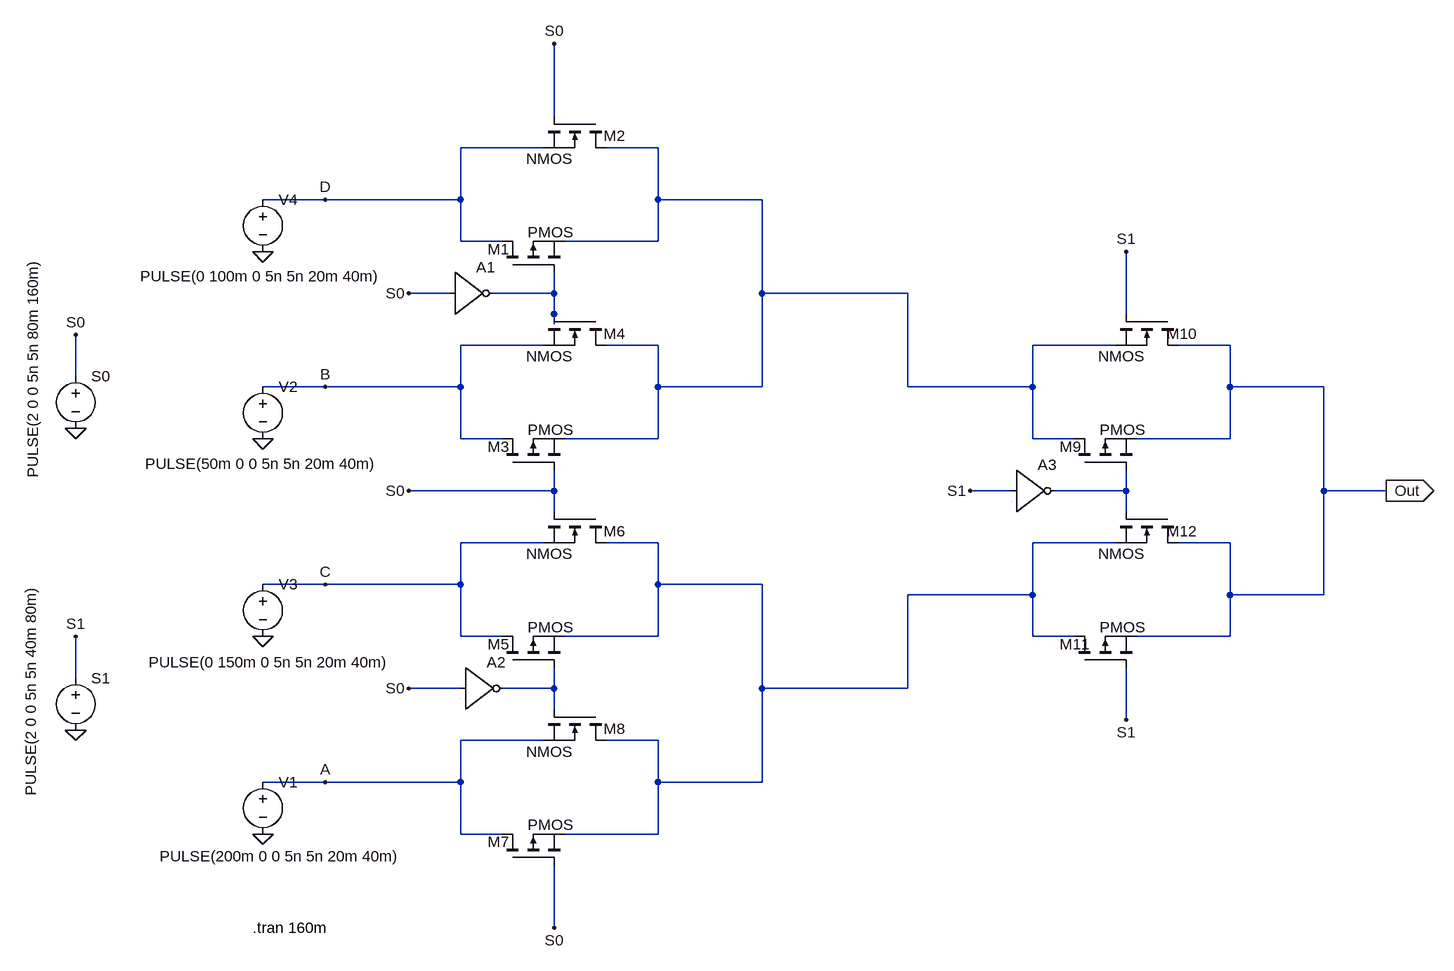
[diagram p0: schematic 4 to 1 mux (1).asc]
4 to 1 mux (1).asc, the LTspice schematic file:
Version 4
SHEET 1 1412 896
WIRE 32 -448 32 -560
WIRE 16 -400 -112 -400
WIRE 192 -400 112 -400
WIRE -320 -320 -416 -320
WIRE -112 -320 -112 -400
WIRE -112 -320 -320 -320
WIRE 192 -320 192 -400
WIRE 352 -320 192 -320
WIRE -112 -256 -112 -320
WIRE -48 -256 -112 -256
WIRE 192 -256 192 -320
WIRE 192 -256 48 -256
WIRE -128 -176 -192 -176
WIRE 32 -176 32 -208
WIRE 32 -176 -64 -176
WIRE 352 -176 352 -320
WIRE 576 -176 352 -176
WIRE 32 -144 32 -176
WIRE 912 -144 912 -240
WIRE 32 -128 32 -144
WIRE 16 -96 -112 -96
WIRE 192 -96 112 -96
WIRE 896 -96 768 -96
WIRE 1072 -96 992 -96
WIRE -704 -48 -704 -112
WIRE -320 -32 -416 -32
WIRE -112 -32 -112 -96
WIRE -112 -32 -320 -32
WIRE 192 -32 192 -96
WIRE 352 -32 352 -176
WIRE 352 -32 192 -32
WIRE 576 -32 576 -176
WIRE 768 -32 768 -96
WIRE 768 -32 576 -32
WIRE 1072 -32 1072 -96
WIRE 1216 -32 1072 -32
WIRE -112 48 -112 -32
WIRE -48 48 -112 48
WIRE 192 48 192 -32
WIRE 192 48 48 48
WIRE 768 48 768 -32
WIRE 832 48 768 48
WIRE 1072 48 1072 -32
WIRE 1072 48 928 48
WIRE 32 128 32 96
WIRE 32 128 -192 128
WIRE 736 128 672 128
WIRE 912 128 912 96
WIRE 912 128 800 128
WIRE 1216 128 1216 -32
WIRE 1312 128 1216 128
WIRE 32 160 32 128
WIRE 912 160 912 128
WIRE 16 208 -112 208
WIRE 192 208 112 208
WIRE 896 208 768 208
WIRE 1072 208 992 208
WIRE -320 272 -416 272
WIRE -112 272 -112 208
WIRE -112 272 -320 272
WIRE 192 272 192 208
WIRE 352 272 192 272
WIRE 768 288 768 208
WIRE 768 288 576 288
WIRE 1072 288 1072 208
WIRE 1216 288 1216 128
WIRE 1216 288 1072 288
WIRE -112 352 -112 272
WIRE -48 352 -112 352
WIRE 192 352 192 272
WIRE 192 352 48 352
WIRE 768 352 768 288
WIRE 832 352 768 352
WIRE 1072 352 1072 288
WIRE 1072 352 928 352
WIRE -704 416 -704 352
WIRE -112 432 -192 432
WIRE 32 432 32 400
WIRE 32 432 -48 432
WIRE 352 432 352 272
WIRE 576 432 576 288
WIRE 576 432 352 432
WIRE 32 464 32 432
WIRE 912 480 912 400
WIRE 16 512 -112 512
WIRE 192 512 112 512
WIRE -320 576 -416 576
WIRE -112 576 -112 512
WIRE -112 576 -320 576
WIRE 192 576 192 512
WIRE 352 576 352 432
WIRE 352 576 192 576
WIRE -112 656 -112 576
WIRE -48 656 -112 656
WIRE 192 656 192 576
WIRE 192 656 48 656
WIRE 32 800 32 704
FLAG 1312 128 Out
IOPIN 1312 128 Out
FLAG -416 -240 0
FLAG -416 48 0
FLAG -416 352 0
FLAG -416 656 0
FLAG -704 32 0
FLAG -704 496 0
FLAG -704 -112 S0
FLAG -704 352 S1
FLAG 672 128 S1
FLAG 912 -240 S1
FLAG 912 480 S1
FLAG -192 -176 S0
FLAG -192 128 S0
FLAG -192 432 S0
FLAG 32 800 S0
FLAG 32 -560 S0
FLAG -320 -32 B
FLAG -320 272 C
FLAG -320 -320 D
FLAG -320 576 A
SYMBOL pmos -48 -208 R270
WINDOW 0 36 -22 VRight 2
WINDOW 3 62 39 VRight 2
SYMATTR InstName M1
SYMBOL nmos 112 -448 R90
WINDOW 0 30 -30 VRight 2
WINDOW 3 65 51 VRight 2
SYMATTR InstName M2
SYMBOL pmos -48 96 R270
WINDOW 0 36 -22 VRight 2
WINDOW 3 62 39 VRight 2
SYMATTR InstName M3
SYMBOL nmos 112 -144 R90
WINDOW 0 30 -30 VRight 2
WINDOW 3 65 51 VRight 2
SYMATTR InstName M4
SYMBOL pmos -48 400 R270
WINDOW 0 36 -22 VRight 2
WINDOW 3 62 39 VRight 2
SYMATTR InstName M5
SYMBOL nmos 112 160 R90
WINDOW 0 30 -30 VRight 2
WINDOW 3 65 51 VRight 2
SYMATTR InstName M6
SYMBOL pmos -48 704 R270
WINDOW 0 36 -22 VRight 2
WINDOW 3 62 39 VRight 2
SYMATTR InstName M7
SYMBOL nmos 112 464 R90
WINDOW 0 30 -30 VRight 2
WINDOW 3 65 51 VRight 2
SYMATTR InstName M8
SYMBOL pmos 832 96 R270
WINDOW 0 36 -22 VRight 2
WINDOW 3 62 39 VRight 2
SYMATTR InstName M9
SYMBOL nmos 992 -144 R90
WINDOW 0 30 -30 VRight 2
WINDOW 3 65 51 VRight 2
SYMATTR InstName M10
SYMBOL pmos 832 400 R270
WINDOW 0 36 -22 VRight 2
WINDOW 3 62 39 VRight 2
SYMATTR InstName M11
SYMBOL nmos 992 160 R90
WINDOW 0 30 -30 VRight 2
WINDOW 3 65 51 VRight 2
SYMATTR InstName M12
SYMBOL voltage -416 560 R0
WINDOW 123 0 0 Left 0
WINDOW 39 0 0 Left 0
WINDOW 3 -159 130 Left 2
SYMATTR InstName V1
SYMATTR Value PULSE(200m 0 0 5n 5n 20m 40m)
SYMBOL voltage -416 -48 R0
WINDOW 123 0 0 Left 0
WINDOW 39 0 0 Left 0
WINDOW 3 -181 134 Left 2
SYMATTR InstName V2
SYMATTR Value PULSE(50m 0 0 5n 5n 20m 40m)
SYMBOL voltage -416 256 R0
WINDOW 123 0 0 Left 0
WINDOW 39 0 0 Left 0
WINDOW 3 -176 136 Left 2
SYMATTR InstName V3
SYMATTR Value PULSE(0 150m 0 5n 5n 20m 40m)
SYMBOL voltage -416 -336 R0
WINDOW 3 -189 134 Left 2
WINDOW 123 0 0 Left 0
WINDOW 39 0 0 Left 0
SYMATTR Value PULSE(0 100m 0 5n 5n 20m 40m)
SYMATTR InstName V4
SYMBOL voltage -704 -64 R0
WINDOW 123 0 0 Left 0
WINDOW 39 0 0 Left 0
WINDOW 3 -66 -165 VRight 2
SYMATTR InstName S0
SYMATTR Value PULSE(2 0 0 5n 5n 80m 160m)
SYMBOL voltage -704 400 R0
WINDOW 123 0 0 Left 0
WINDOW 39 0 0 Left 0
WINDOW 3 -69 -127 VRight 2
SYMATTR InstName S1
SYMATTR Value PULSE(2 0 0 5n 5n 40m 80m)
SYMBOL Digital\\inv -128 -240 R0
SYMATTR InstName A1
SYMBOL Digital\\inv -112 368 R0
SYMATTR InstName A2
SYMBOL Digital\\inv 736 64 R0
SYMATTR InstName A3
TEXT -432 800 Left 2 !.tran 160m

The netlist it stands for:
* 4 to 1 mux (1).asc
M1 D N002 N001 N001 PMOS
M2 N001 S0 D D NMOS
M3 B S0 N001 N001 PMOS
M4 N001 N002 B B NMOS
M5 C N005 N004 N004 PMOS
M6 N004 S0 C C NMOS
M7 A S0 N004 N004 PMOS
M8 N004 N005 A A NMOS
M9 N001 N003 Out Out PMOS
M10 Out S1 N001 N001 NMOS
M11 N004 S1 Out Out PMOS
M12 Out N003 N004 N004 NMOS
V1 A 0 PULSE(200m 0 0 5n 5n 20m 40m)
V2 B 0 PULSE(50m 0 0 5n 5n 20m 40m)
V3 C 0 PULSE(0 150m 0 5n 5n 20m 40m)
V4 D 0 PULSE(0 100m 0 5n 5n 20m 40m)
V§S0 S0 0 PULSE(2 0 0 5n 5n 80m 160m)
V§S1 S1 0 PULSE(2 0 0 5n 5n 40m 80m)
A1 S0 0 0 0 0 N002 0 0 BUF
A2 S0 0 0 0 0 N005 0 0 BUF
A3 S1 0 0 0 0 N003 0 0 BUF
.model NMOS NMOS
.model PMOS PMOS
.lib standard.mos
.tran 160m
.backanno
.end